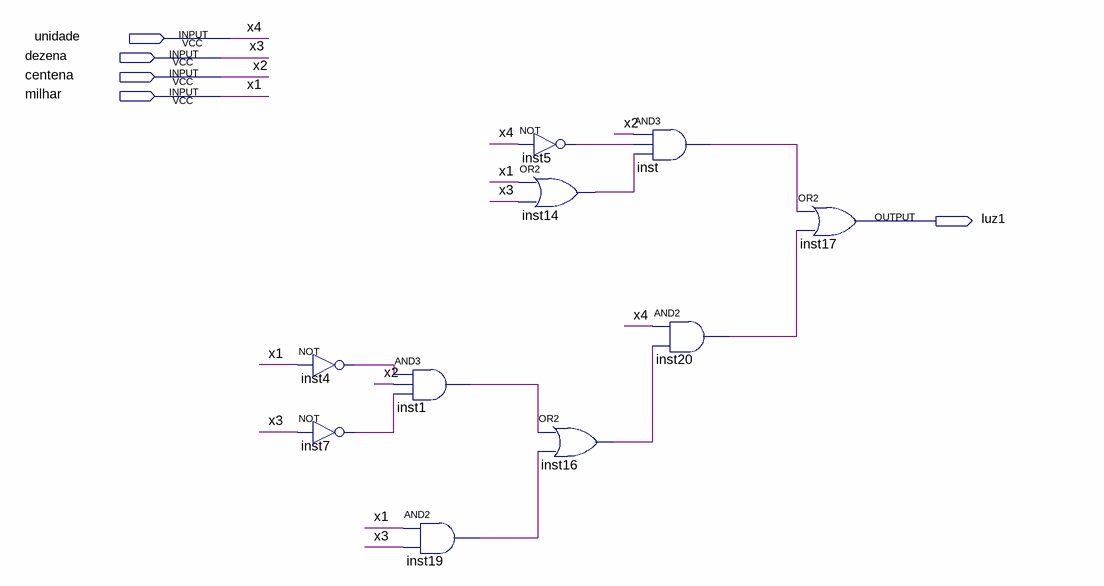
[diagram p0: schematic sheet]
// Quartus schematic luz1.bdf as structural Verilog: 10 symbols, 5 pins
module luz1 (
  input  unidade,
  input  dezena,
  input  centena,
  input  milhar,
  output luz1
);

  wire inst1_out, inst4_out, inst5_out, inst7_out, inst14_out, inst16_out, inst19_out, inst20_out, inst_out;

  not inst4 (inst4_out, milhar);
  not inst7 (inst7_out, dezena);
  and inst1 (inst1_out, inst4_out, centena, inst7_out);
  and inst19 (inst19_out, milhar, dezena);
  not inst5 (inst5_out, unidade);
  or inst14 (inst14_out, milhar, dezena);
  or inst16 (inst16_out, inst1_out, inst19_out);
  and inst (inst_out, centena, inst5_out, inst14_out);
  and inst20 (inst20_out, unidade, inst16_out);
  or inst17 (luz1, inst_out, inst20_out);

  // Other names for the same wires on the sheet: x1 = milhar; x2 = centena; x3 = dezena; x4 = unidade
endmodule
